# Altium schematic sheet 电子脚铐便携式主控板-Frame.SchDoc
size A4
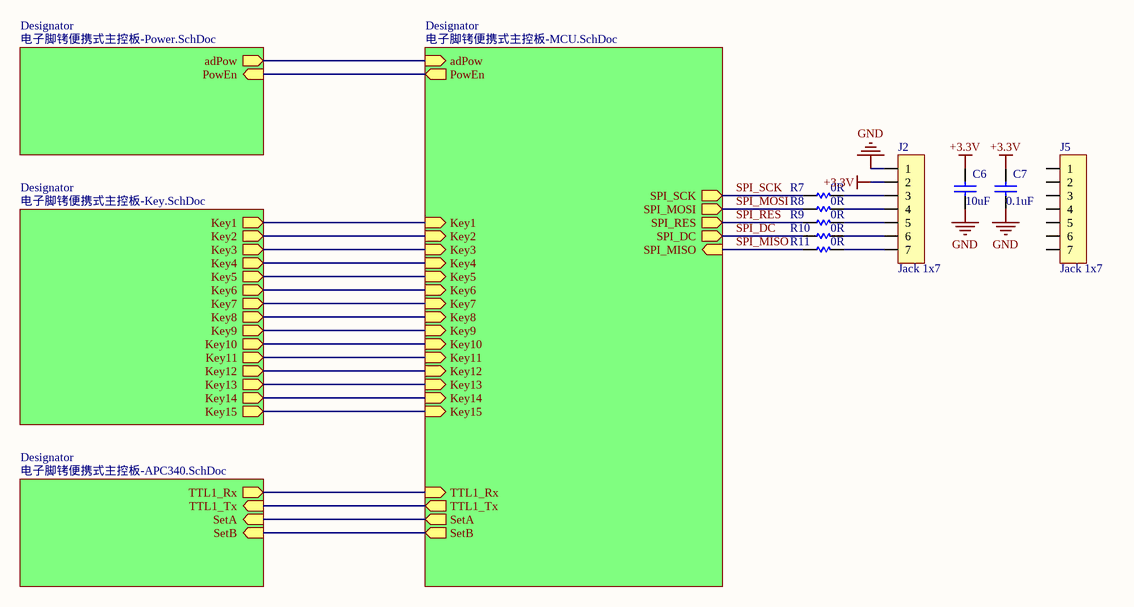
[diagram p0: 电子脚铐便携式主控板-Frame.SchDoc]

## Parts
C6  10uF  [C0603]
C7  0.1uF  [C0603]
J2  Jack 1x7  [ZH-7AWD]
J5  Jack 1x7  [1.54OLED]
R7  0R  [R0603]
R8  0R  [R0603]
R9  0R  [R0603]
R10  0R  [R0603]
R11  0R  [R0603]

## Sub-sheets
Designator = 电子脚铐便携式主控板-Power.SchDoc: adPow (out), PowEn (in)
Designator = 电子脚铐便携式主控板-Key.SchDoc: Key1 (out), Key2 (out), Key3 (out), Key4 (out), Key5 (out), Key6 (out), Key7 (out), Key8 (out), Key9 (out), Key10 (out), Key11 (out), Key12 (out), Key13 (out), Key14 (out), Key15 (out)
Designator = 电子脚铐便携式主控板-MCU.SchDoc: adPow (in), PowEn (out), Key1 (in), Key2 (in), Key3 (in), Key4 (in), Key5 (in), Key6 (in), Key7 (in), Key8 (in), Key9 (in), Key10 (in), Key11 (in), Key12 (in), Key13 (in), Key14 (in), Key15 (in), TTL1_Rx (in), TTL1_Tx (out), SetA (out), SPI_MISO (in), SPI_MOSI (out), SPI_DC (out), SPI_SCK (out), SetB (out), SPI_RES (out)
Designator = 电子脚铐便携式主控板-APC340.SchDoc: TTL1_Rx (out), TTL1_Tx (in), SetA (in), SetB (in)

## Nets
+3.3V: C6.1 C7.1 J2.2
GND: C6.2 C7.2 J2.1
SPI_DC: R10.1 ; sheet Designator/SPI_DC
SPI_MISO: R11.1 ; sheet Designator/SPI_MISO
SPI_MOSI: R8.1 ; sheet Designator/SPI_MOSI
SPI_RES: R9.1 ; sheet Designator/SPI_RES
SPI_SCK: R7.1 ; sheet Designator/SPI_SCK
NetJ2_3: J2.3 R7.2
NetJ2_4: J2.4 R8.2
NetJ2_5: J2.5 R9.2
NetJ2_6: J2.6 R10.2
NetJ2_7: J2.7 R11.2
(unnamed): sheet Designator/adPow, sheet Designator/adPow
(unnamed): sheet Designator/PowEn, sheet Designator/PowEn
(unnamed): sheet Designator/Key1, sheet Designator/Key1
(unnamed): sheet Designator/Key2, sheet Designator/Key2
(unnamed): sheet Designator/Key3, sheet Designator/Key3
(unnamed): sheet Designator/Key4, sheet Designator/Key4
(unnamed): sheet Designator/Key5, sheet Designator/Key5
(unnamed): sheet Designator/Key6, sheet Designator/Key6
(unnamed): sheet Designator/Key7, sheet Designator/Key7
(unnamed): sheet Designator/Key8, sheet Designator/Key8
(unnamed): sheet Designator/Key9, sheet Designator/Key9
(unnamed): sheet Designator/Key10, sheet Designator/Key10
(unnamed): sheet Designator/Key11, sheet Designator/Key11
(unnamed): sheet Designator/Key12, sheet Designator/Key12
(unnamed): sheet Designator/Key13, sheet Designator/Key13
(unnamed): sheet Designator/Key14, sheet Designator/Key14
(unnamed): sheet Designator/Key15, sheet Designator/Key15
(unnamed): sheet Designator/TTL1_Rx, sheet Designator/TTL1_Rx
(unnamed): sheet Designator/TTL1_Tx, sheet Designator/TTL1_Tx
(unnamed): sheet Designator/SetA, sheet Designator/SetA
(unnamed): sheet Designator/SetB, sheet Designator/SetB

Not connected (* = marked no-connect by the designer): J5 1 2 3 4 5 6 7

## Notes on the sheet
- 文件名:
- 审核:
- 制图人:
- 孟浩
- 校对:
- 图号:
- 批准:
- 日期:

## Library data of the parts
C6 C7 = CAP
J2 J5 = Jack 1x7: 插座
R7-R11 = Res